# Altium project ESE5160_Co1n1oT.PrjPcb (part 1 of 2)
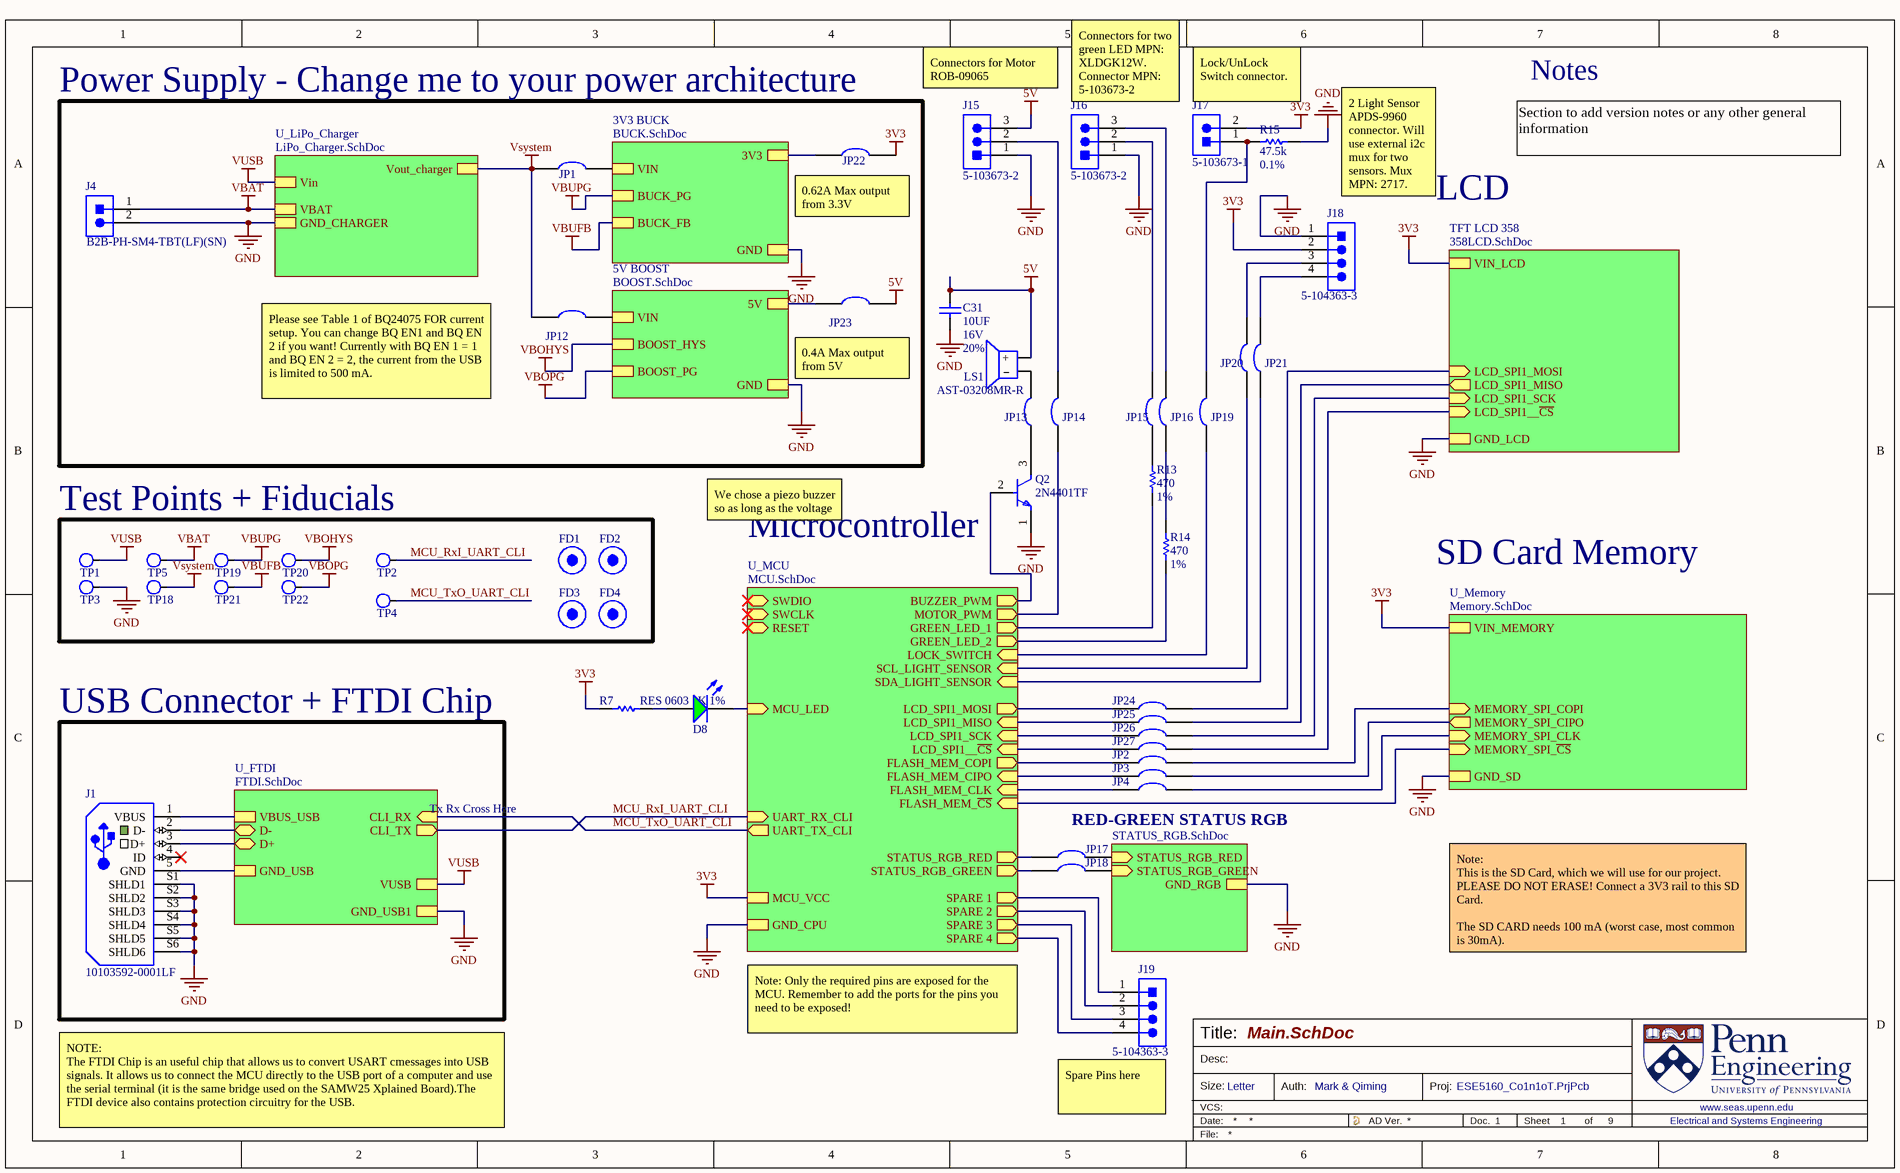
[diagram p0: Main.SchDoc]
9 sheets, 129 parts. Net scope: strictly hierarchical (ports join the sheet entries above them; power ports are local).
Board file: Co1n1oT.PcbDoc
Sheets:
  Main.SchDoc
    U_FTDI = FTDI.SchDoc
    U_MCU = MCU.SchDoc
    U_LiPo_Charger = LiPo_Charger.SchDoc
    U_Memory = Memory.SchDoc
    3V3 BUCK = BUCK.SchDoc
    5V BOOST = BOOST.SchDoc
    RED-GREEN STATUS RGB = STATUS_RGB.SchDoc
    TFT LCD 358 = 358LCD.SchDoc

## Sheet Main.SchDoc
size Legal; Author: Mark & Qiming; DocumentNumber: 1; SheetNumber: 1; SheetTotal: 9

### Parts
C31  value 10UF  Voltage: 16V  Tolerance: 20%  [0603_CAP]  (hidden comment: CAP 0603 10UF 16V 20% X5R)
D8  LSM0805452V  [LED_0805]  (value not drawn)
FD1  Fiducial 40x100mm  [Fiducial 40x100mm-Footprint-1]  (value not drawn)  (no BOM)
FD2  Fiducial 40x100mm  [Fiducial 40x100mm-Footprint-1]  (value not drawn)  (no BOM)
FD3  Fiducial 40x100mm  [Fiducial 40x100mm-Footprint-1]  (value not drawn)  (no BOM)
FD4  Fiducial 40x100mm  [Fiducial 40x100mm-Footprint-1]  (value not drawn)  (no BOM)
J1  10103592-0001LF  [10103592-0001LF-Footprint-1]
J4  B2B-PH-SM4-TBT(LF)(SN)  [FP-B2B-PH-SM4-TBT_LF_SN-MFG]
J15  5-103673-2  [5-103673-2-Footprint-1]
J16  5-103673-2  [5-103673-2-Footprint-1]
J17  5-103673-1  [5-103672-1-Footprint-1]
J18  5-104363-3  [5-104363-3-Footprint-1]
J19  5-104363-3  [5-104363-3-Footprint-1]
JP1  0603 link  [0603_JP_RES]  (value not drawn)  (net tie, no BOM)
JP2  0603 link  [0603_JP_RES]  (value not drawn)  (net tie, no BOM)
JP3  0603 link  [0603_JP_RES]  (value not drawn)  (net tie, no BOM)
JP4  0603 link  [0603_JP_RES]  (value not drawn)  (net tie, no BOM)
JP12  0603 link  [0603_JP_RES]  (value not drawn)  (net tie, no BOM)
JP13  0603 link  [0603_JP_RES]  (value not drawn)  (net tie, no BOM)
JP14  0603 link  [0603_JP_RES]  (value not drawn)  (net tie, no BOM)
JP15  0603 link  [0603_JP_RES]  (value not drawn)  (net tie, no BOM)
JP16  0603 link  [0603_JP_RES]  (value not drawn)  (net tie, no BOM)
JP17  0603 link  [0603_JP_RES]  (value not drawn)  (net tie, no BOM)
JP18  0603 link  [0603_JP_RES]  (value not drawn)  (net tie, no BOM)
JP19  0603 link  [0603_JP_RES]  (value not drawn)  (net tie, no BOM)
JP20  0603 link  [0603_JP_RES]  (value not drawn)  (net tie, no BOM)
JP21  0603 link  [0603_JP_RES]  (value not drawn)  (net tie, no BOM)
JP22  0603 link  [0603_JP_RES]  (value not drawn)  (net tie, no BOM)
JP23  0603 link  [0603_JP_RES]  (value not drawn)  (net tie, no BOM)
JP24  0603 link  [0603_JP_RES]  (value not drawn)  (net tie, no BOM)
JP25  0603 link  [0603_JP_RES]  (value not drawn)  (net tie, no BOM)
JP26  0603 link  [0603_JP_RES]  (value not drawn)  (net tie, no BOM)
JP27  0603 link  [0603_JP_RES]  (value not drawn)  (net tie, no BOM)
LS1  AST-03208MR-R  [AST-03208MR-R]
Q2  2N4401TF  [FP-135AR-MFG]
R7  RES 0603 1K 1%  [0603_RES]
R13  value 470  Tolerance: 1%  [0805_RES]  (hidden comment: RES 0805 470 1%)
R14  value 470  Tolerance: 1%  [0805_RES]  (hidden comment: RES 0805 470 1%)
R15  value 47.5k  Tolerance: 0.1%  [0805_RES]  (hidden comment: RES 0805 47.5K 0.1%)
TP1  Testpad  [SMT Testpoint, 50mil]  (value not drawn)  (no BOM)
TP2  Testpad  [SMT Testpoint, 50mil]  (value not drawn)  (no BOM)
TP3  Testpad  [SMT Testpoint, 50mil]  (value not drawn)  (no BOM)
TP4  Testpad  [SMT Testpoint, 50mil]  (value not drawn)  (no BOM)
TP5  Testpad  [Test PTH 27-50]  (value not drawn)  (no BOM)
TP18  Testpad  [Test PTH 27-50]  (value not drawn)  (no BOM)
TP19  Testpad  [SMT Testpoint, 50mil]  (value not drawn)  (no BOM)
TP20  Testpad  [SMT Testpoint, 50mil]  (value not drawn)  (no BOM)
TP21  Testpad  [SMT Testpoint, 50mil]  (value not drawn)  (no BOM)
TP22  Testpad  [SMT Testpoint, 50mil]  (value not drawn)  (no BOM)

### Blocks framed on the sheet
Power Supply - Change me to your power architecture: J4 JP1 JP12 JP22 JP23
Test Points + Fiducials: FD1-FD4 TP1-TP5 TP18-TP22
USB Connector + FTDI Chip: J1

### Sub-sheets
3V3 BUCK = BUCK.SchDoc: 3V3, VIN, BUCK_PG, BUCK_FB, GND
5V BOOST = BOOST.SchDoc: VIN, 5V, BOOST_HYS, BOOST_PG, GND
RED-GREEN STATUS RGB = STATUS_RGB.SchDoc: STATUS_RGB_RED (in), STATUS_RGB_GREEN (in), GND_RGB
TFT LCD 358 = 358LCD.SchDoc: LCD_SPI1_MOSI (in), LCD_SPI1_MISO (out), LCD_SPI1__~{CS} (in), LCD_SPI1_SCK (in), GND_LCD, VIN_LCD
U_FTDI = FTDI.SchDoc: CLI_RX (in), CLI_TX (out), VUSB, GND_USB1, VBUS_USB, D- (bidir), D+ (bidir), GND_USB
U_LiPo_Charger = LiPo_Charger.SchDoc: Vin, GND_CHARGER, VBAT, Vout_charger
U_MCU = MCU.SchDoc: SWDIO (bidir), SWCLK (in), UART_TX_CLI (out), UART_RX_CLI (in), RESET (bidir), MCU_LED (in), MCU_VCC, GND_CPU, FLASH_MEM_~{CS} (in), FLASH_MEM_CLK (in), FLASH_MEM_CIPO (in), FLASH_MEM_COPI (out), MOTOR_PWM (out), GREEN_LED_1 (out), GREEN_LED_2 (out), BUZZER_PWM (out), STATUS_RGB_GREEN (out), STATUS_RGB_RED (out), LOCK_SWITCH (in), SCL_LIGHT_SENSOR (in), SDA_LIGHT_SENSOR (in), LCD_SPI1_SCK (in), LCD_SPI1__~{CS} (in), LCD_SPI1_MOSI (out), LCD_SPI1_MISO (in), SPARE 1 (out), SPARE 2 (out), SPARE 3 (out), SPARE 4 (out)
U_Memory = Memory.SchDoc: MEMORY_SPI_COPI (in), MEMORY_SPI_CIPO (out), MEMORY_SPI_CLK (in), MEMORY_SPI_~{CS} (in), VIN_MEMORY, GND_SD

### Nets
3V3: J17.2 J18.2 JP22.2 R7.2 ; sheet U_MCU/MCU_VCC, sheet U_Memory/VIN_MEMORY, sheet TFT LCD 358/VIN_LCD
5V: C31.2 J15.3 JP23.2 LS1.1(+)
GND: C31.1 J1.5(GND) J1.S1(SHLD1) J1.S2(SHLD2) J1.S3(SHLD3) J1.S4(SHLD4) J1.S5(SHLD5) J1.S6(SHLD6) J4.2 J15.1 J16.1 J18.1 Q2.1(E) R15.2 TP3.1 ; sheet U_FTDI/GND_USB1, sheet U_FTDI/GND_USB, sheet U_MCU/GND_CPU, sheet U_LiPo_Charger/GND_CHARGER, sheet U_Memory/GND_SD, sheet 3V3 BUCK/GND, sheet 5V BOOST/GND, sheet RED-GREEN STATUS RGB/GND_RGB, sheet TFT LCD 358/GND_LCD
IN: JP12.2 ; sheet 5V BOOST/VIN
OUT: JP22.1 ; sheet 3V3 BUCK/3V3
VBAT: J4.1 TP5.1 ; sheet U_LiPo_Charger/VBAT
VBOHYS: TP20.1 ; sheet 5V BOOST/BOOST_HYS
VBOPG: TP22.1 ; sheet 5V BOOST/BOOST_PG
VBUFB: TP21.1 ; sheet 3V3 BUCK/BUCK_FB
VBUPG: TP19.1 ; sheet 3V3 BUCK/BUCK_PG
VBUS: J1.1(VBUS) ; sheet U_FTDI/VBUS_USB
VIN: JP1.2 ; sheet 3V3 BUCK/VIN
Vout: JP23.1 ; sheet 5V BOOST/5V
Vsystem: JP1.1 JP12.1 TP18.1 ; sheet U_LiPo_Charger/Vout_charger
VUSB: TP1.1 ; sheet U_FTDI/VUSB, sheet U_LiPo_Charger/Vin
BUZZER PWM-: Q2.2(B) ; sheet U_MCU/BUZZER_PWM
FLASH_MEM_SPI_~{CS}: sheet U_MCU/FLASH_MEM_~{CS}, sheet U_Memory/MEMORY_SPI_~{CS}
GREEN_LED_1: R13.1 ; sheet U_MCU/GREEN_LED_1
GREEN_LED_2: R14.1 ; sheet U_MCU/GREEN_LED_2
I2C_0(SCL) LIGHT SENSOR: JP20.1 ; sheet U_MCU/SCL_LIGHT_SENSOR
I2C_0(SDA) LIGHT SENSOR: JP21.1 ; sheet U_MCU/SDA_LIGHT_SENSOR
LCD_~{CS}: JP27.2 ; sheet TFT LCD 358/LCD_SPI1__~{CS}
LCD_CLK: JP26.2 ; sheet TFT LCD 358/LCD_SPI1_SCK
LCD_MISO: JP25.2 ; sheet TFT LCD 358/LCD_SPI1_MISO
LCD_MOSI: JP24.2 ; sheet TFT LCD 358/LCD_SPI1_MOSI
LCD_SPI1_~{CS}: JP27.1 ; sheet U_MCU/LCD_SPI1__~{CS}
LCD_SPI1_CLK: JP26.1 ; sheet U_MCU/LCD_SPI1_SCK
LCD_SPI1_MISO: JP25.1 ; sheet U_MCU/LCD_SPI1_MISO
LCD_SPI1_MOSI: JP24.1 ; sheet U_MCU/LCD_SPI1_MOSI
LOCK_SIGNAL_SWITCH: JP19.1 ; sheet U_MCU/LOCK_SWITCH
MCU_LED: D8.K ; sheet U_MCU/MCU_LED
MCU_RxI_UART_CLI: TP2.1 ; sheet U_FTDI/CLI_TX, sheet U_MCU/UART_RX_CLI
MCU_TxO_UART_CLI: TP4.1 ; sheet U_FTDI/CLI_RX, sheet U_MCU/UART_TX_CLI
MEM_SPI_CIPO: JP3.2 ; sheet U_Memory/MEMORY_SPI_CIPO
MEM_SPI_CLK: JP4.2 ; sheet U_Memory/MEMORY_SPI_CLK
MEM_SPI_COPI: JP2.2 ; sheet U_Memory/MEMORY_SPI_COPI
MOTOR PWM+: JP14.1 ; sheet U_MCU/MOTOR_PWM
SERCOM1_PAD2_SPI_CIPO: JP3.1 ; sheet U_MCU/FLASH_MEM_CIPO
SERCOM1_PAD2_SPI_COPI: JP2.1 ; sheet U_MCU/FLASH_MEM_COPI
SERCOM1_PAD3_SPI_SCK: JP4.1 ; sheet U_MCU/FLASH_MEM_CLK
SPARE 1: J19.1 ; sheet U_MCU/SPARE 1
SPARE 2: J19.2 ; sheet U_MCU/SPARE 2
SPARE 3: J19.3 ; sheet U_MCU/SPARE 3
SPARE 4: J19.4 ; sheet U_MCU/SPARE 4
STATUS RGB PIN_1: JP17.1 ; sheet U_MCU/STATUS_RGB_RED
STATUS RGB PIN_2: JP18.1 ; sheet U_MCU/STATUS_RGB_GREEN
STATUS_RGB_GREEN: JP18.2 ; sheet RED-GREEN STATUS RGB/STATUS_RGB_GREEN
STATUS_RGB_RED: JP17.2 ; sheet RED-GREEN STATUS RGB/STATUS_RGB_RED
USB_DATA_N: J1.2(D-) ; sheet U_FTDI/D-
USB_DATA_P: J1.3(D+) ; sheet U_FTDI/D+
NetD8_A: D8.A R7.1
NetJ15_2: J15.2 JP14.2
NetJ16_2: J16.2 JP15.2
NetJ16_3: J16.3 JP16.2
NetJ17_1: J17.1 JP19.2 R15.1
NetJ18_3: J18.3 JP20.2
NetJ18_4: J18.4 JP21.2
NetJP13_1: JP13.1 Q2.3(C)
NetJP13_2: JP13.2 LS1.2(‒)
NetJP15_1: JP15.1 R13.2
NetJP16_1: JP16.1 R14.2

Not connected (* = marked no-connect by the designer): FD1 0(PAD); FD2 0(PAD); FD3 0(PAD); FD4 0(PAD); J1 4(ID)*

### Notes on the sheet
- Connectors for Motor ROB-09065
- (near J16) Connectors for two green LED MPN: XLDGK12W. Connector MPN: 5-103673-2
- Lock/UnLock Switch connector.
- Notes
- Section to add version notes or any other general information
- (near JP22) 0.62A Max output from 3.3V
- 2 Light Sensor APDS-9960 connector. Will use external i2c mux for two sensors. Mux MPN: 2717.
- LCD
- 0.4A Max output from 5V
- Please see Table 1 of BQ24075 FOR current setup. You can change BQ EN1 and BQ EN 2 if you want! Currently with BQ EN 1 = 1 and BQ EN 2 = 2, the current from the USB is limited to 500 mA.
- We chose a piezo buzzer so as long as the voltage is correct and we limit the current it should be good
- (near Q2) Microcontroller
- SD Card Memory
- Tx Rx Cross Here
- Note:
  This is the SD Card, which we will use for our project. PLEASE DO NOT ERASE! Connect a 3V3 rail to this SD Card.
  The SD CARD needs 100 mA (worst case, most common is 30mA).
- Note: Only the required pins are exposed for the MCU. Remember to add the ports for the pins you need to be exposed!
- NOTE:
  The FTDI Chip is an useful chip that allows us to convert USART cmessages into USB signals. It allows us to connect the MCU directly to the USB port of a computer and use the serial terminal (it is the same bridge used on the SAMW25 Xplained Board).The FTDI device also contains protection circuitry for the USB.
- (near J19) Spare Pins here
- Title:
- Desc:
- Size:
- Letter
- Auth:
- Proj:
- Sheet
- of
- www.seas.upenn.edu
- Electrical and Systems Engineering

### Library data of the parts
C31 = CMP-011-000263-1: Capacitor Surface Mount 0603 Footprint 10UF 16V 20% Tolerance Ceramic X5R; Manufacturer: Various; Description in Visual: Cap SMT 0603 10UF 16V 20% Ceramic X5R; PCB Package: 0603; Type: Ceramic X5R; Mount: SMT; P/N: CAP 0603 10UF 16V 20% X5R; Manufacturer P/N: CAP 0603 10UF 16V 20% X5R
D8 = CMP-00038-3: Single Color LED, Green, 0805; Test Current: 20mA; Forward Voltage: 2V; RoHS Compliant: Yes
FD1 FD3 FD4 = CMP-00085-3
FD2 = CMP-00085-2
J1 = CMP-00092-5: Conn Micro USB 2.0 Type B RCP 5 POS 0.65mm Solder RA SMD 5 Terminal 1 Port T/R
J4 = CMP-00418-1: Connector Header, PH Series, 2 Position, 2.00mm, 100V, Surface Mount, Solder, Pick and Place, Natural.
J15 J16 = CMP-00385-1: Board Connector, 3 Contact(s), 1 Row(s), Male, Right Angle, Solder Terminal, Black Insulator; Option: General Purpose; MIL Conformance: No; Number of Contacts: 3; Mating Information: MULTIPLE MATING PARTS AVAILABLE; Number of Rows Loaded: 1; Additional Feature: POLARIZED; Flammability Rating: UL94 V-0; RoHS Compliant: Yes; JESD-609 Code: e3; Contact Finish - Mating: NOT SPECIFIED; Reach SVHC Compliant: Yes; Connector Type: BOARD CONNECTOR; Filter Feature: No; IEC Conformance: No; Mounting Style: RIGHT ANGLE; Terminal Pitch: 2.54mm; Contact Material: Brass; Termination: Solder; Mounting Technology: Board; Mixed Contacts: No; Contact Finish - Termination: TIN; Contact Gender: Male; DIN Conformance: No
J17 = CMP-00384-1: Board Connector, 2 Contact(s), 1 Row(s), Male, Right Angle, 0.1 inch Pitch, Solder Terminal, Latch, Black Insulator, Receptacle; DIN Conformance: No; Rated Current (Signal): 3A; Number of Contacts: 2; Contact Pattern: RECTANGULAR; Body Depth: 0.535inch; Number Of PCB Rows: 1; Mating Information: MULTIPLE MATING PARTS AVAILABLE; Contact Style: SQ PIN-SKT; Option: General Purpose; Body Breadth: 0.275inch; Additional Feature: POLARIZED; Dielectric Withstanding Voltage (AC): 600V; Contact Resistance: 15mR; Plating Thickness: 15uin; Mounting Option 2: LOCKING; Reliability: COMMERCIAL; Body Length: 0.3inch; Insulation Resistance: 5GR; Board Mounting Option: HOLE .125-.137; Reference Standard: UL; Polarization Key: POLARIZED HOUSING; Min Operating Temperature: -65°C; Mating Contact Pitch: 0.1inch; Contact Gender: Male; Mounting Option 1: LATCH; Mounting Style: RIGHT ANGLE; Terminal Length: 0.13inch; Contact Material: Brass; PCB Contact Pattern: RECTANGULAR; JESD-609 Code: e3; Mounting Technology: Board; Body/Shell Style: RECEPTACLE; Contact Finish - Mating: NOT SPECIFIED; Number of Rows Loaded: 1; Termination: Solder; Terminal Pitch: 2.54mm; Contact Finish - Termination: TIN; IEC Conformance: No; Filter Feature: No; MIL Conformance: No; Reach SVHC Compliant: Yes; Number Of Connectors: 1; Insulation Material: Thermoplastic; Connector Type: BOARD CONNECTOR; Max Operating Temperature: 105°C; Mixed Contacts: No; Flammability Rating: UL94 V-0; Insulation Color: Black; RoHS Compliant: Yes
J18 J19 = CMP-00105-2: Board Connector, 4 Contact(s), 1 Row(s), Male, Straight, 0.1 inch Pitch, Solder Terminal, Locking, Black Insulator, Plug
JP1-JP4 JP12-JP27 = CMP-00422-2: 0O link, SMD, 0603, Solder Bridge Option; Manufacturer P/N: Various; Manufacturer: Generic; Description in Visual: 0O link, Solder Bridge/SMD, Open; Value: 0.025; Source: Shunts and Jumpers.SchLib; Pin Count: 2; Design Item ID: 0603 link; Component Type: Net Tie; P/N: 0603 link
LS1 = CMP-000049-2: 8 Ohms General Purpose Speaker 100 mW 500 Hz ~ 20 kHz Top Round
Q2 = CMP-00278-84408871-1: 2N4401TF Transistor General Purpose BJT NPN 40 Volt 0.6 Amp 3-Pin TO-92 Tape And Reel; Manufacturer Lifecycle Status: ACTIVE; Collector Emitter Voltage (VCEO): 40V; Max Frequency: 250MHz; Current Rating: 600mA; Element Configuration: Single; Max Power Dissipation: 625mW; Emitter Base Voltage (VEBO): 6V; Collector Emitter Saturation Voltage: 400mV; Max Junction Temperature (Tj): 150°C; Collector Base Voltage (VCBO): 60V; Number of Elements: 1; hFE Min: 100; Lifecycle Status: Production; Collector Emitter Breakdown Voltage: 40V; Lead Free: Lead Free; Gain Bandwidth Product: 250MHz; Number of Pins: 3; Length: 5.2mm; Case/Package: TO-92; RoHS: Compliant; Radiation Hardening: No; Height: 5.33mm; Schedule B: 8541210080, 8541210080; Voltage Rating (DC): 40V; REACH SVHC: No SVHC; Frequency: 250MHz; Width: 4.19mm; Power Dissipation: 625mW; Transition Frequency: 250MHz; Weight: 240mg; Mount: Through Hole; Polarity: NPN; Max Operating Temperature: 150°C; Min Operating Temperature: -55°C; NexarPartId: 84408871; Max Breakdown Voltage: 40V; Packaging: Tape and Reel; Max Collector Current: 600mA
R7 = CMP-005-002503-3: Resistor Surface Mount, 1K Ohms, 0603 Footprint, 1% Tolerance 0.1W; Manufacturer: Various; PCB Package: 0603; Description in Visual: Res SMT 1K 0603  1%  0.1W; Tolerance: 1%; Value: 1k; Mount: SMT; Power Rating: 0.1W; Manufacturer P/N: RES 0603 1K 1%; JLCPCB Part #: C21190
R13 R14 = CMP-005-005142-2: Resistor Surface Mount, 470 Ohms, 0805 Footprint, 1% Tolerance 0.125W; Manufacturer P/N: RES 0805 470R 1%; Manufacturer: Various; PCB Package: 0805; Description in Visual: Res SMT 470 0805  1%  0.125W; Power Rating: 0.125W; Mount: SMT
R15 = CMP-005-005139-2: Resistor Surface Mount, 47.5K Ohms, 0805 Footprint, 0.1% Tolerance 0.125W; Manufacturer: Various; PCB Package: 0805; Description in Visual: Res SMT 47.5K 0805  0.1%  0.125W; Mount: SMT; Power Rating: 0.125W; Manufacturer P/N: RES 0805 47.5K 0.1%
TP1-TP5 TP18-TP22 = CMP-00049-4: Test Pad/Point (Testpoint, Testpad), for probing

## Sheet FTDI.SchDoc
size Legal; Author: Mark & Qiming; DocumentNumber: 5; SheetNumber: 5; SheetTotal: 9
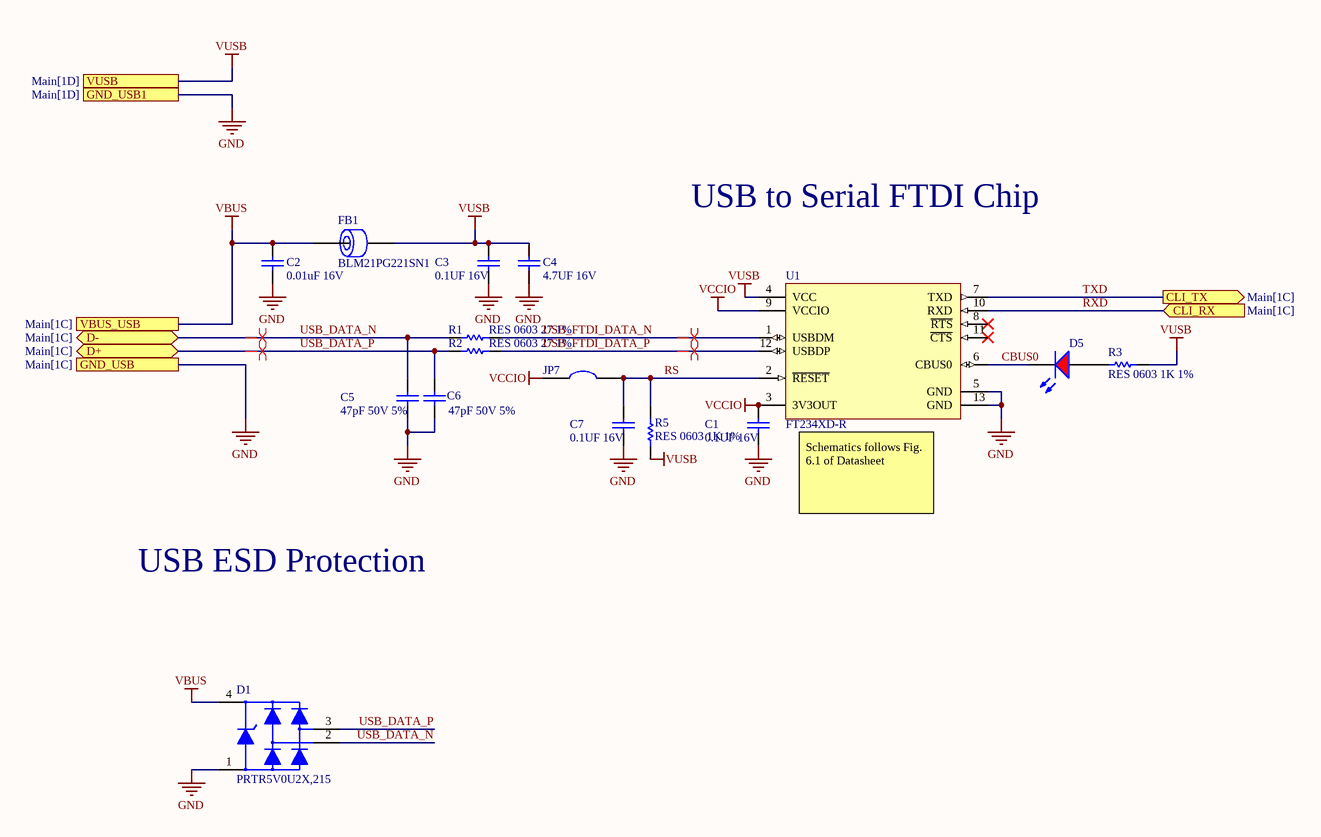
[diagram p1: FTDI.SchDoc]

### Parts
C1  0.1UF 16V  [0603_CAP]
C2  0.01uF 16V  [0603_CAP]
C3  0.1UF 16V  [0603_CAP]
C4  4.7UF 16V  [0805_CAP]
C5  47pF 50V 5%  [0603_CAP]
C6  47pF 50V 5%  [0603_CAP]
C7  0.1UF 16V  [0603_CAP]
D1  PRTR5V0U2X,215  [FP-SOT143B-NXP]
D5  LSM0805412V  [LED_0805_RED]  (value not drawn)
FB1  BLM21PG221SN1  [0805]
JP7  0603 link  [0603_JP_RES]  (value not drawn)  (net tie, no BOM)
R1  RES 0603 27 1%  [0603_RES]
R2  RES 0603 27 1%  [0603_RES]
R3  RES 0603 1K 1%  [0603_RES]
R5  RES 0603 1K 1%  [0603_RES]
U1  FT234XD-R  [FP-DFN-12-MFG]

### Ports
CLI_RX (in, see Main[1C]), CLI_TX (out, see Main[1C]), D+ (bidir, see Main[1C]), D- (bidir, see Main[1C]), GND_USB1 (see Main[1D]), GND_USB (see Main[1C]), VBUS_USB (see Main[1C]), VUSB (see Main[1D])

### Nets
GND: C1.1 C2.1 C3.1 C4.1 C5.1 C6.1 C7.1 D1.1 U1.5(GND) U1.13(GND) ; port GND_USB1, port GND_USB
VBUS: C2.2 D1.4 FB1.1 ; port VBUS_USB
VCCIO: C1.2 JP7.1 U1.3(3V3OUT) U1.9(VCCIO)
VUSB: C3.2 C4.2 FB1.2 R3.1 R5.1 U1.4(VCC) ; port VUSB
CBUS0: D5.K U1.6(CBUS0)  [project net CBUS0_5]
RS: C7.2 JP7.2 R5.2 U1.2(~{RESET})  [project net RS_5]
RXD: U1.10(RXD) ; port CLI_RX  [project net MCU_TxO_UART_CLI]
TXD: U1.7(TXD) ; port CLI_TX  [project net MCU_RxI_UART_CLI]
USB_DATA_N: C5.2 D1.2 R1.1 ; port D-
USB_DATA_P: C6.2 D1.3 R2.1 ; port D+
USB_FTDI_DATA_N: R1.2 U1.1(USBDM)  [project net USB_FTDI_DATA_N_5]
USB_FTDI_DATA_P: R2.2 U1.12(USBDP)  [project net USB_FTDI_DATA_P_5]
NetD5_A: D5.A R3.2

Not connected (* = marked no-connect by the designer): U1 8(~{RTS})* 11(~{CTS})*

### Layout directives
differential pair; differential pair class USB; net class USB: USB_DATA_N, USB_DATA_P, USB_FTDI_DATA_N_5, USB_FTDI_DATA_P_5

### Notes on the sheet
- USB to Serial FTDI Chip
- Schematics follows Fig. 6.1 of Datasheet
- USB ESD Protection
- Title:
- Desc:
- Size:
- Letter
- Auth:
- Proj:
- Sheet
- of
- www.seas.upenn.edu
- Electrical and Systems Engineering

### Library data of the parts
C1 C3 C7 = CMP-011-000221-1: Capacitor Surface Mount 0603 Footprint 0.1UF 16V 10% Tolerance Ceramic X7R; Manufacturer P/N: CAP 0603 0.1UF 16V 10% X7R; Manufacturer: Various; Description in Visual: Cap SMT 0603 0.1UF 16V 10%  Cer X7R; PCB Package: 0603; Mount: SMT; Type: Ceramic X7R; Voltage: 16V; P/N: CAP 0603 0.1UF 16V 10% X7R; Value: 0.1UF; Tolerance: 10%
C2 = CMP-011-000185-1: Capacitor Surface Mount 0603 Footprint 0.01UF 16V 10% Tolerance Ceramic X7R; Manufacturer: Various; Manufacturer P/N: CAP 0603 0.01UF 16V 10% X7R; Description in Visual: Cap SMT 0603 0.01UF 16V 10%  Cer X7R; PCB Package: 0603; Type: Ceramic X7R; Value: 0.01UF; P/N: CAP 0603 0.01UF 16V 10% X7R; Voltage: 16V; Tolerance: 10%; Mount: SMT
C4 = CMP-011-000523-1: Capacitor Surface Mount 0805 Footprint 4.7UF 16V 10% Tolerance Ceramic X7R; Manufacturer P/N: CAP 0805 4.7UF 16V 10% X7R; Manufacturer: Various; PCB Package: 0805; Description in Visual: Cap SMT 0805 4.7UF 16V 10%  Cer X7R; Mount: SMT; P/N: CAP 0805 4.7UF 16V 10% X7R; Type: Ceramic X7R; Voltage: 16V; Tolerance: 10%; Value: 4.7UF
C5 C6 = CMP-011-000339-1: Capacitor Surface Mount 0603 Footprint 47PF 50V 5% Tolerance Ceramic C0G; Manufacturer P/N: CAP 0603 47PF 50V 5% C0G; Manufacturer: Various; Description in Visual: Cap SMT 0603 47PF 50V 5%  Cer C0G; PCB Package: 0603; Value: 47PF; Voltage: 50V; P/N: CAP 0603 47PF 50V 5% C0G; Mount: SMT; Tolerance: 5%; Type: Ceramic C0G
D1 = CMP-00371-1: Trans Voltage Suppressor Diode, 5.5V V(RWM), Unidirectional, 1 Element, Silicon; Min Breakdown Voltage: 6V; Number of Elements: 1; Time @ Peak Reflow Temperature-Max (s): 30s; Max Breakdown Voltage: 9V; Package Body Material: Plastic; Case Connection: ANODE; Surface Mount: Yes; Terminal Finish: Tin; Package Style: SMALL OUTLINEMeter; Moisture Sensitivity Level: 1; Reach SVHC Compliant: Yes; Terminal Position: DUAL; Pins: 4; Polarity: Unidirectional; Diode Type: TRANS VOLTAGE SUPPRESSOR; Package Shape: Rectangular; Terminal Form: Gull Wing; RoHS Compliant: Yes; JESD-609 Code: e3; Rep Pk Reverse Voltage-Max: 5.5V; Diode Element Material: SILICON; JESD-30 Code: R-PDSO-G4; Technology: AVALANCHE; Peak Reflow Temperature (Cel): 260°C
D5 = CMP-00026-00001-1: Single Color LED, RED, 0805; Test Current: 20mA; Forward Voltage: 2V; RoHS Compliant: Yes
FB1 = CMP-00229-4: Ferrite Chip 2000 mA 220 Ohms Differential Mode - Single 0805 Footprint; Manufacturer: Murata; Description in Visual: Ferrite SMT 2000mA 220Ohm Dif Mode 0805; Frequency: 100MHz; Usage: Power Supply; DC Resistance (ohms): 0.05; Impedance at Freq (ohms): 220Hz; Current (mA): 2000; ComponentLink3Description: Octopart Link; PCB Package: 0805; Operating Temperature Range: -55 to +125 °C; ComponentLink2URL: http://search.murata.co.jp/Ceramy/image/img/PDF/ENG/L0110S0100BLM21P.pdf; ComponentLink3URL: http://octopart.com/partsearch/#search/requestData&q=BLM21PG221SN1; ComponentLink1URL: http://www.murata.com; Manufacturer P/N: BLM21PG221SN1; ComponentLink2Description: Component Datasheet; ComponentLink1Description: Manufacturer Website; Filter type: Differential Mode - Single; P/N: BLM21PG221SN1
JP7 = CMP-00422-2: as JP1 on sheet Main; Source: Shunts and Jumpers.SchLib; Pin Count: 2; Design Item ID: 0603 link; Component Type: Net Tie; P/N: 0603 link
R1 R2 = CMP-005-002764-2: Resistor Surface Mount, 27 Ohms, 0603 Footprint, 1% Tolerance 0.1W; Manufacturer P/N: RES 0603 27R 1%; Manufacturer: Various; Description in Visual: Res SMT 27 0603  1%  0.1W; Value: 27; PCB Package: 0603; Mount: SMT; Tolerance: 1%; Power Rating: 0.1W
R3 R5 = CMP-005-002503-3: as R7 on sheet Main; Tolerance: 1%; Value: 1k; Mount: SMT; Power Rating: 0.1W; Manufacturer P/N: RES 0603 1K 1%; JLCPCB Part #: C21190
U1 = CMP-00104-3: USB Bridge, USB to UART USB 2.0 UART Interface 12-DFN (3x3); Nominal Supply Voltage: 5V; Qualification Status: Not Qualified; Package Body Material: Plastic; Time @ Peak Reflow Temperature-Max (s): 40s; Min Supply Voltage: 2.97V; Max Supply Voltage: 5.5V; Power Supplies: 1.8/3.3,3.3/5V; Package Style: SMALL OUTLINE, HEAT SINK/SLUG, THIN PROFILEMeter; Technology: CMOS; Terminal Pitch: 0.45mm; Terminal Position: DUAL; Moisture Sensitivity Level: 3; Reach SVHC Compliant: Yes; Length: 3mm; Package Shape: Square; Pins: 12; RoHS Compliant: Yes; Temperature Grade: INDUSTRIAL; Min Operating Temperature: -40°C; Peak Reflow Temperature (Cel): 260°C; Surface Mount: Yes; Terminal Form: No Lead; Max Operating Temperature: 85°C; Case/Package: HTSON; Width: 3mm

## Sheet MCU.SchDoc
size Legal; Author: Mark & Qiming; DocumentNumber: 3; SheetNumber: 3; SheetTotal: 9
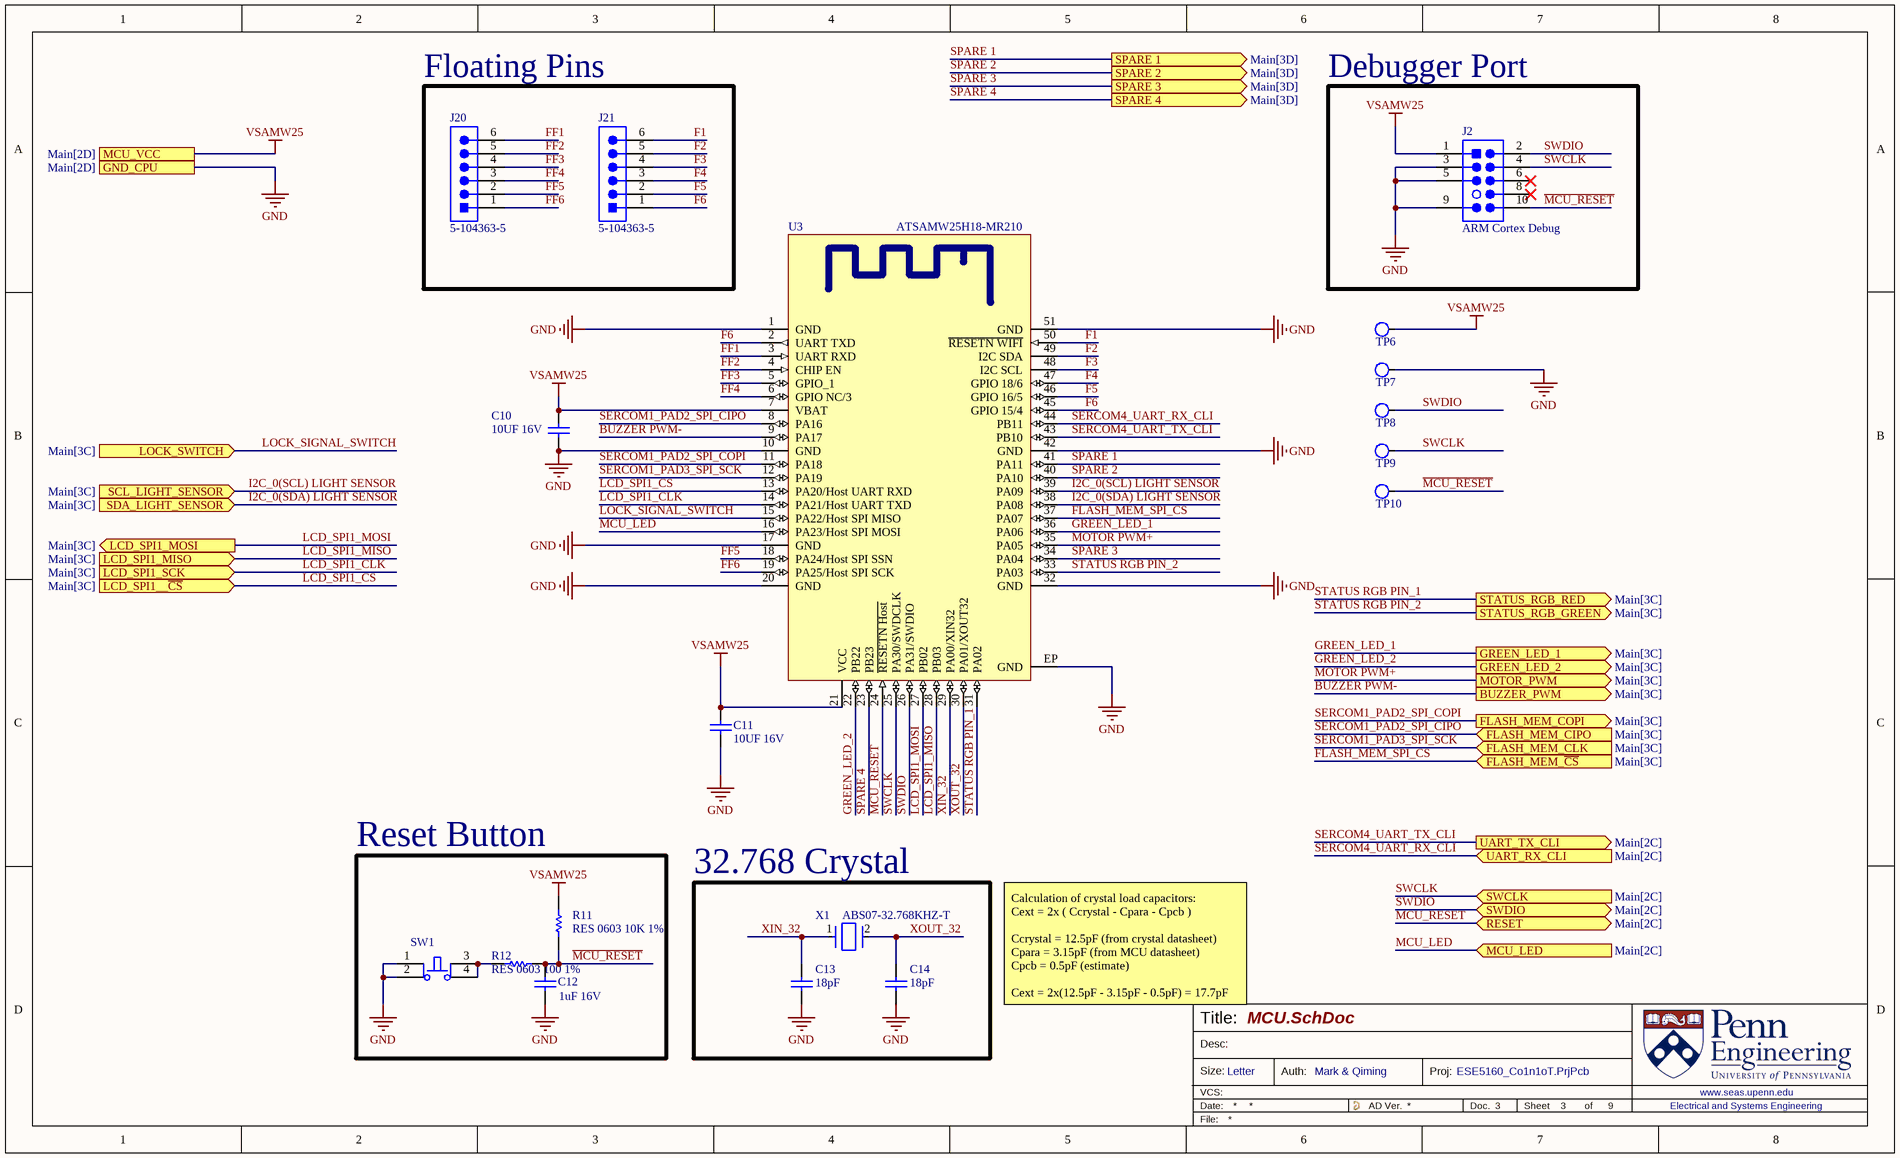
[diagram p2: MCU.SchDoc]

### Parts
C10  10UF 16V  [0805_CAP_60H]
C11  10UF 16V  [0805_CAP_60H]
C12  1uF 16V  [0603_CAP]
C13  18pF  [0603_CAP]
C14  18pF  [0603_CAP]
J2  ARM Cortex Debug  [FTSH-105-01-F-DV-007-K PLUGIN]
J20  5-104363-5  [5-104363-5-Footprint-1]
J21  5-104363-5  [5-104363-5-Footprint-1]
R11  RES 0603 10K 1%  [0603_RES]
R12  RES 0603 100 1%  [0603_RES]
SW1  PTS810SJK250SMTRLFS  [PTS810SJK250SMTRLFS-Footprint-1]  (value not drawn)
TP6  Testpad  [SMT Testpoint, 50mil]  (value not drawn)  (no BOM)
TP7  Testpad  [SMT Testpoint, 50mil]  (value not drawn)  (no BOM)
TP8  Testpad  [SMT Testpoint, 50mil]  (value not drawn)  (no BOM)
TP9  Testpad  [SMT Testpoint, 50mil]  (value not drawn)  (no BOM)
TP10  Testpad  [SMT Testpoint, 50mil]  (value not drawn)  (no BOM)
U3  ATSAMW25H18-MR210  [ATSAMW25H18-MR210-Footprint-1]
X1  ABS07-32.768KHZ-T  [FP-ABS07-MFG]

### Blocks framed on the sheet
Floating Pins: J20 J21
Debugger Port: J2
Reset Button: C12 R11 R12 SW1
32.768 Crystal: C13 C14 X1

### Ports
BUZZER_PWM (out, see Main[3C]), FLASH_MEM_CIPO (in, see Main[3C]), FLASH_MEM_CLK (in, see Main[3C]), FLASH_MEM_COPI (out, see Main[3C]), FLASH_MEM_~{CS} (in, see Main[3C]), GND_CPU (see Main[2D]), GREEN_LED_1 (out, see Main[3C]), GREEN_LED_2 (out, see Main[3C]), LCD_SPI1__~{CS} (in, see Main[3C]), LCD_SPI1_MISO (in, see Main[3C]), LCD_SPI1_MOSI (out, see Main[3C]), LCD_SPI1_SCK (in, see Main[3C]), LOCK_SWITCH (in, see Main[3C]), MCU_LED (in, see Main[2C]), MCU_VCC (see Main[2D]), MOTOR_PWM (out, see Main[3C]), RESET (bidir, see Main[2C]), SCL_LIGHT_SENSOR (in, see Main[3C]), SDA_LIGHT_SENSOR (in, see Main[3C]), SPARE 1 (out, see Main[3D]), SPARE 2 (out, see Main[3D]), SPARE 3 (out, see Main[3D]), SPARE 4 (out, see Main[3D]), STATUS_RGB_GREEN (out, see Main[3C]), STATUS_RGB_RED (out, see Main[3C]), SWCLK (in, see Main[2C]), SWDIO (bidir, see Main[2C]), UART_RX_CLI (in, see Main[2C]), UART_TX_CLI (out, see Main[2C])

### Nets
GND: C10.1 C11.2 C12.1 C13.1 C14.1 J2.3 J2.5 J2.9 SW1.1 SW1.2 TP7.1 U3.1(GND) U3.10(GND) U3.17(GND) U3.20(GND) U3.32(GND) U3.42(GND) U3.51(GND) U3.EP(GND) ; port GND_CPU
VSAMW25: C10.2 C11.1 J2.1 R11.2 TP6.1 U3.7(VBAT) U3.21(VCC) ; port MCU_VCC  [project net 3V3]
BUZZER PWM-: U3.9(PA17) ; port BUZZER_PWM
F1: J21.6 U3.50(~{RESETN_WIFI})  [project net F1_3]
F2: J21.5 U3.49(I2C_SDA)  [project net F2_3]
F3: J21.4 U3.48(I2C_SCL)  [project net F3_3]
F4: J21.3 U3.47(GPIO_18/6)  [project net F4_3]
F5: J21.2 U3.46(GPIO_16/5)  [project net F5_3]
F6: J21.1 U3.2(UART_TXD) U3.45(GPIO_15/4)  [project net F6_3]
FF1: J20.6 U3.3(UART_RXD)  [project net FF1_3]
FF2: J20.5 U3.4(CHIP_EN)  [project net FF2_3]
FF3: J20.4 U3.5(GPIO_1)  [project net FF3_3]
FF4: J20.3 U3.6(GPIO_NC/3)  [project net FF4_3]
FF5: J20.2 U3.18(PA24/Host_SPI_SSN)  [project net FF5_3]
FF6: J20.1 U3.19(PA25/Host_SPI_SCK)  [project net FF6_3]
FLASH_MEM_SPI_~{CS}: U3.37(PA07) ; port FLASH_MEM_~{CS}
GREEN_LED_1: U3.36(PA06) ; port GREEN_LED_1
GREEN_LED_2: U3.22(PB22) ; port GREEN_LED_2
I2C_0(SCL) LIGHT SENSOR: U3.39(PA09) ; port SCL_LIGHT_SENSOR
I2C_0(SDA) LIGHT SENSOR: U3.38(PA08) ; port SDA_LIGHT_SENSOR
LCD_SPI1_~{CS}: U3.13(PA20/Host_UART_RXD) ; port LCD_SPI1__~{CS}
LCD_SPI1_CLK: U3.14(PA21/Host_UART_TXD) ; port LCD_SPI1_SCK
LCD_SPI1_MISO: U3.28(PB03) ; port LCD_SPI1_MISO
LCD_SPI1_MOSI: U3.27(PB02) ; port LCD_SPI1_MOSI
LOCK_SIGNAL_SWITCH: U3.15(PA22/Host_SPI_MISO) ; port LOCK_SWITCH
~{MCU_RESET}: C12.2 J2.10 R11.1 R12.2 TP10.1 U3.24(~{RESETN_Host})  [project net ~{MCU_RESET}_3]
MCU_LED: U3.16(PA23/Host_SPI_MOSI) ; port MCU_LED
MCU_RESET: port RESET
MOTOR PWM+: U3.35(PA05) ; port MOTOR_PWM
SERCOM1_PAD2_SPI_CIPO: U3.8(PA16) ; port FLASH_MEM_CIPO
SERCOM1_PAD2_SPI_COPI: U3.11(PA18) ; port FLASH_MEM_COPI
SERCOM1_PAD3_SPI_SCK: U3.12(PA19) ; port FLASH_MEM_CLK
SERCOM4_UART_RX_CLI: U3.44(PB11) ; port UART_RX_CLI  [project net MCU_RxI_UART_CLI]
SERCOM4_UART_TX_CLI: U3.43(PB10) ; port UART_TX_CLI  [project net MCU_TxO_UART_CLI]
SPARE 1: U3.41(PA11) ; port SPARE 1
SPARE 2: U3.40(PA10) ; port SPARE 2
SPARE 3: U3.34(PA04) ; port SPARE 3
SPARE 4: U3.23(PB23) ; port SPARE 4
STATUS RGB PIN_1: U3.31(PA02) ; port STATUS_RGB_RED
STATUS RGB PIN_2: U3.33(PA03) ; port STATUS_RGB_GREEN
SWCLK: J2.4 TP9.1 U3.25(PA30/SWDCLK) ; port SWCLK
SWDIO: J2.2 TP8.1 U3.26(PA31/SWDIO) ; port SWDIO
XIN_32: C13.2 U3.29(PA00/XIN32) X1.1  [project net XIN_32_3]
XOUT_32: C14.2 U3.30(PA01/XOUT32) X1.2  [project net XOUT_32_3]
NetR12_1: R12.1 SW1.3 SW1.4

Not connected (* = marked no-connect by the designer): J2 6* 8*

### Notes on the sheet
- Calculation of crystal load capacitors:
  Cext = 2x ( Ccrystal - Cpara - Cpcb )
  Ccrystal = 12.5pF (from crystal datasheet)
  Cpara = 3.15pF (from MCU datasheet)
  Cpcb = 0.5pF (estimate)
  Cext = 2x(12.5pF - 3.15pF - 0.5pF) = 17.7pF
- Title:
- Desc:
- Size:
- Letter
- Auth:
- Proj:
- Sheet
- of
- www.seas.upenn.edu
- Electrical and Systems Engineering

### Library data of the parts
C10 C11 = CMP-011-000479-1: Capacitor Surface Mount 0805 Footprint 10UF 16V 20% Tolerance Ceramic X7R; Manufacturer: Various; Manufacturer P/N: CAP 0805 10UF 16V 20% X7R; PCB Package: 0805; Description in Visual: Cap SMT 0805 10UF 16V 20% Ceramic X7R; Tolerance: 20%; Type: Ceramic X7R; Mount: SMT; P/N: CAP 0805 10UF 16V 20% X7R; Voltage: 16V; Value: 10UF
C12 = CMP-011-000286-1: Capacitor Surface Mount 0603 Footprint 1UF 16V 10% Tolerance Ceramic X7R; Manufacturer: Various; P/N: CAP 0603 1UF 16V 10% X7R; PCB Package: 0603; Description in Visual: Cap SMT 0603 1UF 16V 10% Ceramic X7R; Manufacturer P/N: CAP 0603 1UF 16V 10% X7R; Tolerance: 10%; Type: Ceramic X7R; Value: 1UF; Mount: SMT; Voltage: 16V
C13 C14 = CMP-011-000283-1: Capacitor Surface Mount 0603 Footprint 18PF 50V 5% Tolerance Ceramic C0G; Manufacturer: Various; Manufacturer P/N: CAP 0603 18PF 50V 5% C0G; Description in Visual: Cap SMT 0603 18PF 50V 5%  Cer C0G; PCB Package: 0603; Voltage: 50V; Type: Ceramic C0G; Tolerance: 5%; Value: 18PF; P/N: CAP 0603 18PF 50V 5% C0G; Mount: SMT
J2 = CMP-002-000013-1: 10 Pin Shrouded Header, 0.050", Key Pin 7; Manufacturer P/N: Various; Manufacturer: Samtech; Gender: Male; Number of Contacts: 10; ComponentLink1URL: http://infocenter.arm.com/help/topic/com.arm.doc.faqs/attached/13634/cortex_debug_connectors.pdf; Description in Visual: 10 Pin Shrouded Header, 0.050", Key Pin 7; P/N: ARM Cortex Debug; Number of Rows: 2; Contact Finish: Gold; ComponentLink1Description: Pinout Reference; ComponentLink2URL: http://suddendocs.samtec.com/catalog_english/ftsh_smt.pdf; Pitch: 0.050"; Orientation: Vertical; ComponentLink2Description: Datasheet for Connector
J20 J21 = CMP-00108-1: Board Connector, 6 Contact(s), 1 Row(s), Male, Straight, 0.1 inch Pitch, Solder Terminal, Locking, Black Insulator, Plug
R11 = CMP-005-002156-3: Resistor Surface Mount, 10K Ohms, 0603 Footprint, 1% Tolerance 0.1W; Manufacturer: Various; PCB Package: 0603; Description in Visual: Res SMT 10K 0603  1%  0.1W; Manufacturer P/N: RES 0603 10K 1%; Tolerance: 1%; Mount: SMT; Value: 10k; JLCPCB Part #: C25804; Power Rating: 0.1W
R12 = CMP-005-002125-2: Resistor Surface Mount, 100 Ohms, 0603 Footprint, 1% Tolerance 0.1W; Manufacturer: Various; Manufacturer P/N: RES 0603 100R 1%; Value: 100; Description in Visual: Res SMT 100 0603  1%  0.1W; PCB Package: 0603; Mount: SMT; Tolerance: 1%; Power Rating: 0.1W
SW1 = CMP-00084-3: Keypad Switch, 1 Switches, SPST, Momentary tactile button, 0.05A, 16VDC, 3.23N, Solder Terminal, Surface Mount-straight; Manufacturer Series: PTS810; Actuator Length: 0.028inch; Electrical Life: 50000Cycles; Contact Resistance: 0.5mR; Solderability: REFLOW; Actuator Travel: 0.1524mm; Actuator Color: White; Actuator Type: Pushbutton; Insulation Resistance: 100MR; Dielectric Withstand Volts: 250VACV; Switch Function: OFF-MOM; Reach SVHC Compliant: Yes; Terminal Finish: Silver; Switch Type: Keypad; Switch Action: MOMENTARY; RoHS Compliant: Yes; JESD-609 Code: e4; Max Operating Temperature: 85°C; Termination: Solder; Min Operating Temperature: -40°C; Mounting Technology: Surface Mount; Circuit: SPST; Type: Tactile
TP6-TP10 = CMP-00049-4: as TP1 on sheet Main
U3 = CMP-00071-2: WiFi 802.11b/g/n Transceiver Module 2.412GHz ~ 2.484GHz Integrated, Trace Surface Mount, Integrated SAMD21 Cortex M0+
X1 = CMP-0447-00001-4: Crystal 32.768kHz ±20ppm (Tol) 12.5pF FUND 70kΩ 2-Pin CSMD T/R; ESR (Equivalent Series Resistance): 70kR; Frequency: 32.768kHz; Radiation Hardening: No; Length: 3.2mm; Max Operating Temperature: 85°C; Number of Pins: 2; Series: ABS07; Min Operating Temperature: -40°C; Frequency Tolerance: 20ppm; Packaging: Tape and Reel; Height: 0.9mm; Width: 1.5mm; Depth: 1.5mm; Load Capacitance: 12.5pF; RoHS Compliant: Yes; Tolerance: 20ppm; Termination: SMD/SMT; Lead Free: Lead Free; Series Resistance: 70kR; REACH SVHC: No SVHC; Case/Package: CSMD; Operating Frequency: 32.768 kHz; Package Quantity: 3000

## Sheet LiPo_Charger.SchDoc
size Legal; Author: Mark & Qiming; DocumentNumber: 6; SheetNumber: 6; SheetTotal: 9
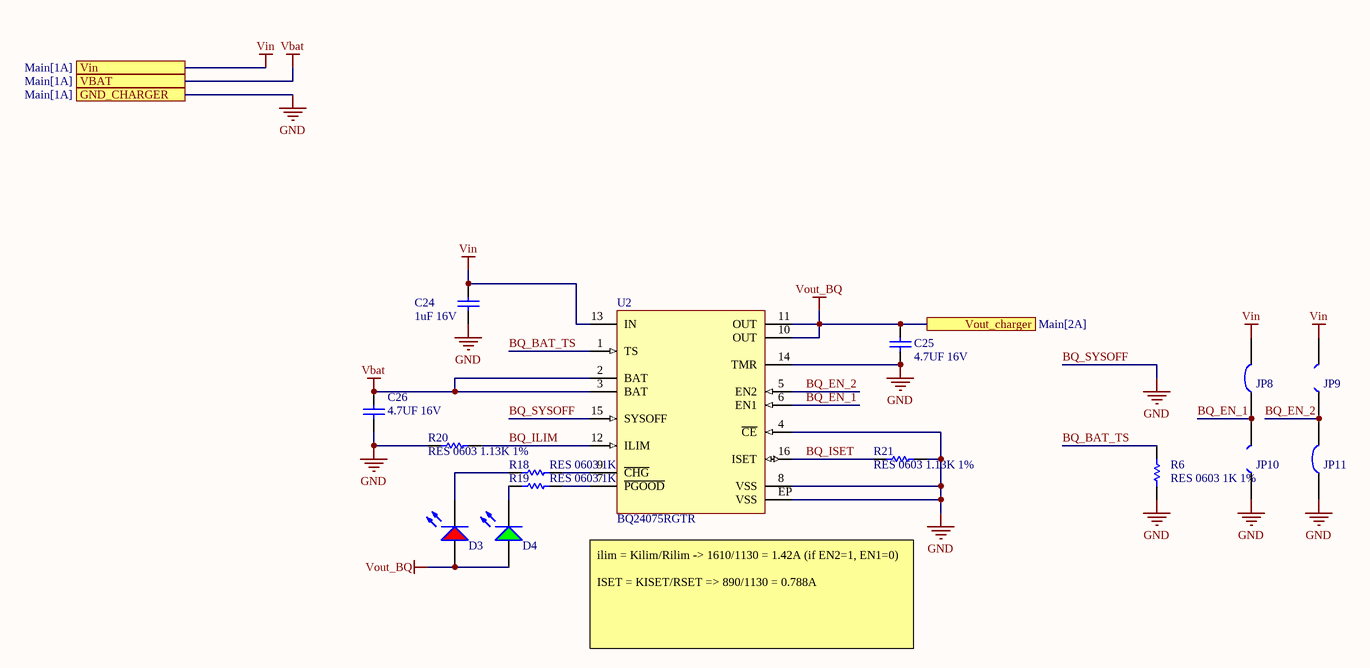
[diagram p3: LiPo_Charger.SchDoc]

### Parts
C24  1uF 16V  [0603_CAP]
C25  4.7UF 16V  [0805_CAP]
C26  4.7UF 16V  [0805_CAP]
D3  LSM0805412V  [LED_0805_RED]  (value not drawn)
D4  LSM0805452V  [LED_0805]  (value not drawn)
JP8  0603 link  [0603_JP_RES]  (value not drawn)  (net tie, no BOM)
JP9  0603 link (Open)  [0603_JP_Open]  (value not drawn)  (no BOM)
JP10  0603 link (Open)  [0603_JP_Open]  (value not drawn)  (no BOM)
JP11  0603 link  [0603_JP_RES]  (value not drawn)  (net tie, no BOM)
R6  RES 0603 1K 1%  [0603_RES]
R18  RES 0603 1K 1%  [0603_RES]
R19  RES 0603 1K 1%  [0603_RES]
R20  RES 0603 1.13K 1%  [0603_RES]
R21  RES 0603 1.13K 1%  [0603_RES]
U2  BQ24075RGTR  [FP-RGT0016C-IPC_A]

### Ports
GND_CHARGER (see Main[1A]), VBAT (see Main[1A]), Vin (see Main[1A]), Vout_charger (see Main[2A])

### Nets
GND: C24.1 C25.1 C26.1 JP10.1 JP11.2 R6.1 R20.1 R21.2 U2.4(~{CE}) U2.8(VSS) U2.14(TMR) U2.15(SYSOFF) U2.EP(VSS) ; port GND_CHARGER  [also labelled BQ_SYSOFF]
VBAT: C26.2 U2.2(BAT) U2.3(BAT) ; port VBAT
Vin: C24.2 JP8.2 JP9.1 U2.13(IN) ; port Vin  [project net VUSB]
Vout_BQ: C25.2 D3.A D4.A U2.10(OUT) U2.11(OUT) ; port Vout_charger  [project net Vsystem]
BQ_BAT_TS: R6.2 U2.1(TS)  [project net BQ_BAT_TS_6]
BQ_EN_1: JP8.1 JP10.2 U2.6(EN1)  [project net BQ_EN_1_6]
BQ_EN_2: JP9.2 JP11.1 U2.5(EN2)  [project net BQ_EN_2_6]
BQ_ILIM: R20.2 U2.12(ILIM)  [project net BQ_ILIM_6]
BQ_ISET: R21.1 U2.16(ISET)  [project net BQ_ISET_6]
NetD3_K: D3.K R18.2
NetD4_K: D4.K R19.2
NetR18_1: R18.1 U2.9(~{CHG})
NetR19_1: R19.1 U2.7(~{PGOOD})

### Notes on the sheet
- (near U2) ilim = Kilim/Rilim -> 1610/1130 = 1.42A (if EN2=1, EN1=0)
  ISET = KISET/RSET => 890/1130 = 0.788A
- Title:
- Desc:
- Size:
- Letter
- Auth:
- Proj:
- Sheet
- of
- www.seas.upenn.edu
- Electrical and Systems Engineering

### Library data of the parts
C24 = CMP-011-000286-1: as C12 on sheet MCU; Manufacturer P/N: CAP 0603 1UF 16V 10% X7R; Tolerance: 10%; Type: Ceramic X7R; Value: 1UF; Mount: SMT; Voltage: 16V
C25 C26 = CMP-011-000523-1: as C4 on sheet FTDI; Mount: SMT; P/N: CAP 0805 4.7UF 16V 10% X7R; Type: Ceramic X7R; Voltage: 16V; Tolerance: 10%; Value: 4.7UF
D3 = CMP-00026-00001-1: as D5 on sheet FTDI; RoHS Compliant: Yes
D4 = CMP-00038-3: as D8 on sheet Main; RoHS Compliant: Yes
JP8 JP11 = CMP-00422-2: as JP1 on sheet Main; Source: Shunts and Jumpers.SchLib; Pin Count: 2; Design Item ID: 0603 link; Component Type: Net Tie; P/N: 0603 link
JP9 JP10 = CMP-00423-2: 0O link, Solder Bridge/SMD, Open; Value: 10000000000meg; P/N: 0603 link (Open); Description in Visual: 0O link, Solder Bridge/SMD, Open; Component Type: Standard (No BOM); Design Item ID: 0603 link (Open); Pin Count: 2; Source: Shunts and Jumpers.SchLib
R6 R18 R19 = CMP-005-002503-3: as R7 on sheet Main; Tolerance: 1%; Value: 1k; Mount: SMT; Power Rating: 0.1W; Manufacturer P/N: RES 0603 1K 1%; JLCPCB Part #: C21190
R20 R21 = CMP-005-001984-2: Resistor Surface Mount, 1.13K Ohms, 0603 Footprint, 1% Tolerance 0.1W; Manufacturer: Various; Description in Visual: Res SMT 1.13K 0603  1%  0.1W; PCB Package: 0603; Power Rating: 0.1W; Mount: SMT; Tolerance: 1%; Manufacturer P/N: RES 0603 1.13K 1%; Value: 1.13k
U2 = CMP-00080-5: Power Supply Support Circuit, Adjustable, 1 Channel, 6.6, PQCC16; Nominal Supply Voltage: 5V; Channels: 1; Min Supply Voltage: 4.35V; Qualification Status: Not Qualified; Power Supplies: 4.5/6.3V; Package Equivalence Code: LCC16,.12SQ,20; Adjustable Threshold: Yes; Package Body Material: Plastic; Max Supply Voltage: 26V; Supply Current-Max (Isup): 1.5mA; Reach SVHC Compliant: Yes; RoHS Compliant: Yes; Throw Configuration: POWER SUPPLY SUPPORT CIRCUIT; Moisture Sensitivity Level: 2; Min Operating Temperature: -40°C; JESD-609 Code: e4; Width: 3mm; Terminal Form: No Lead; Terminal Finish: Nickel; Terminal Position: QUAD; Height - Seated (Max): 1mm; Temperature Grade: INDUSTRIAL; Case/Package: HVQCCN; Length: 3mm; Max Operating Temperature: 85°C; Peak Reflow Temperature (Cel): 260°C; Number of Channels: 1; Package Shape: Square; Package Style: CHIP CARRIER, HEAT SINK/SLUG, VERY THIN PROFILEMeter; Surface Mount: Yes; Pins: 16; JESD-30 Code: S-PQCC-N16; Terminal Pitch: 0.5mm

## Sheet Memory.SchDoc
size Legal; Author: Mark & Qiming; DocumentNumber: 2; SheetNumber: 2; SheetTotal: 9
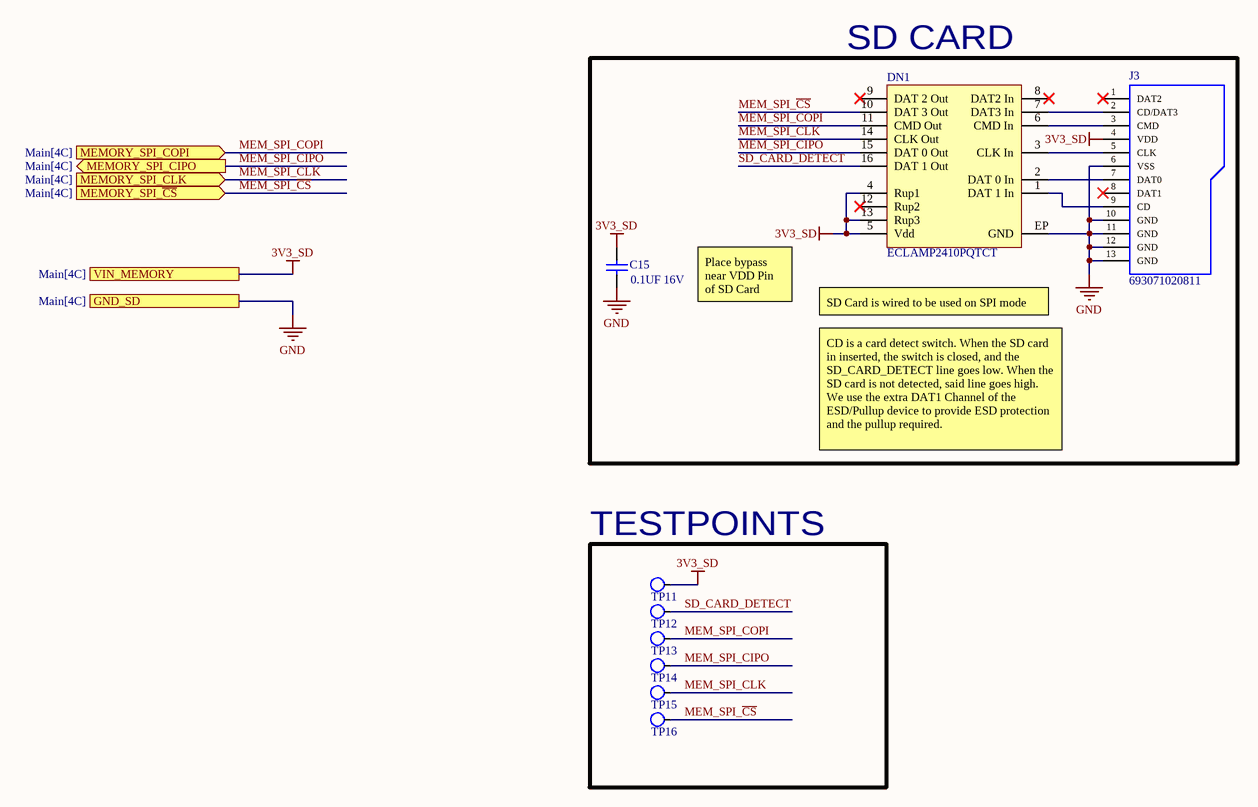
[diagram p4: Memory.SchDoc]

### Parts
C15  0.1UF 16V  [0603_CAP]
DN1  ECLAMP2410PQTCT  [ECLAMP2410PQTCT-Footprint-1]
J3  693071020811  [693071020811]
TP11  Testpad  [SMT Testpoint, 50mil]  (value not drawn)  (no BOM)
TP12  Testpad  [SMT Testpoint, 50mil]  (value not drawn)  (no BOM)
TP13  Testpad  [SMT Testpoint, 50mil]  (value not drawn)  (no BOM)
TP14  Testpad  [SMT Testpoint, 50mil]  (value not drawn)  (no BOM)
TP15  Testpad  [SMT Testpoint, 50mil]  (value not drawn)  (no BOM)
TP16  Testpad  [SMT Testpoint, 50mil]  (value not drawn)  (no BOM)

### Blocks framed on the sheet
SD CARD: C15 DN1 J3
TESTPOINTS: TP11-TP16

### Ports
GND_SD (see Main[4C]), MEMORY_SPI_CIPO (out, see Main[4C]), MEMORY_SPI_CLK (in, see Main[4C]), MEMORY_SPI_COPI (in, see Main[4C]), MEMORY_SPI_~{CS} (in, see Main[4C]), VIN_MEMORY (see Main[4C])

### Nets
3V3_SD: C15.2 DN1.4(Rup1) DN1.5(Vdd) DN1.13(Rup3) J3.4(VDD) TP11.1 ; port VIN_MEMORY  [project net 3V3]
GND: C15.1 DN1.EP(GND) J3.6(VSS) J3.10(GND) J3.11(GND) J3.12(GND) J3.13(GND) ; port GND_SD
MEM_SPI_~{CS}: DN1.10(DAT_3_Out) TP16.1 ; port MEMORY_SPI_~{CS}  [project net FLASH_MEM_SPI_~{CS}]
MEM_SPI_CIPO: DN1.15(DAT_0_Out) TP14.1 ; port MEMORY_SPI_CIPO
MEM_SPI_CLK: DN1.14(CLK_Out) TP15.1 ; port MEMORY_SPI_CLK
MEM_SPI_COPI: DN1.11(CMD_Out) TP13.1 ; port MEMORY_SPI_COPI
SD_CARD_DETECT: DN1.16(DAT_1_Out) TP12.1  [project net SD_CARD_DETECT_2]
NetDN1_1: DN1.1(DAT_1_In) J3.9(CD)
NetDN1_2: DN1.2(DAT_0_In) J3.7(DAT0)
NetDN1_3: DN1.3(CLK_In) J3.5(CLK)
NetDN1_6: DN1.6(CMD_In) J3.3(CMD)
NetDN1_7: DN1.7(DAT3_In) J3.2(CD/DAT3)

Not connected (* = marked no-connect by the designer): DN1 8(DAT2_In)* 9(DAT_2_Out)* 12(Rup2)*; J3 1(DAT2)* 8(DAT1)*

### Notes on the sheet
- Place bypass near VDD Pin of SD Card
- SD Card is wired to be used on SPI mode
- CD is a card detect switch. When the SD card in inserted, the switch is closed, and the SD_CARD_DETECT line goes low. When the SD card is not detected, said line goes high. We use the extra DAT1 Channel of the ESD/Pullup device to provide ESD protection and the pullup required.
- Title:
- Desc:
- Size:
- Letter
- Auth:
- Proj:
- Sheet
- of
- www.seas.upenn.edu
- Electrical and Systems Engineering

### Library data of the parts
C15 = CMP-011-000221-1: as C1 on sheet FTDI; Mount: SMT; Type: Ceramic X7R; Voltage: 16V; P/N: CAP 0603 0.1UF 16V 10% X7R; Value: 0.1UF; Tolerance: 10%
DN1 = CMP-00096-2: Trans Voltage Suppressor Diode, 5V V(RWM), Bidirectional, 7 Element, Silicon with EMI Filter; Filter Type: DATA LINE FILTER; Reach SVHC Compliant: Yes; RoHS Compliant: Yes
J3 = CMP-00419-3: WR-CRD Micro SD Card Connector Push & Push; Rated Current: 0.5A; Working Voltage: 30VAC; Contact Resistance: 100mOhm; Gender: Socket; Withstanding Voltage: 500VAC; Pin Number: 8; Mounting Technology: SMT; Source: WR-CRD.SchLib; Type: Push & Push; ComponentLink2Description: Datasheet; Packaging: Tape and Reel; ComponentLink1Description: Manufacturer; Design Item ID: 693071020811; Memory Card Type: Micro SD; Publisher: Wurth Elektronik; Operating Temperature: -40 to +85degC; ComponentLink2URL: https://katalog.we-online.com/em/datasheet/693071020811.pdf; Number of Contacts: 8; Part Number: 693071020811; Published Date: November 2019; ComponentLink1URL: http://www.we-online.de
TP11-TP16 = CMP-00049-4: as TP1 on sheet Main

## Sheet BUCK.SchDoc
size Legal; Author: Mark & Qiming; DocumentNumber: 8; SheetNumber: 7; SheetTotal: 9
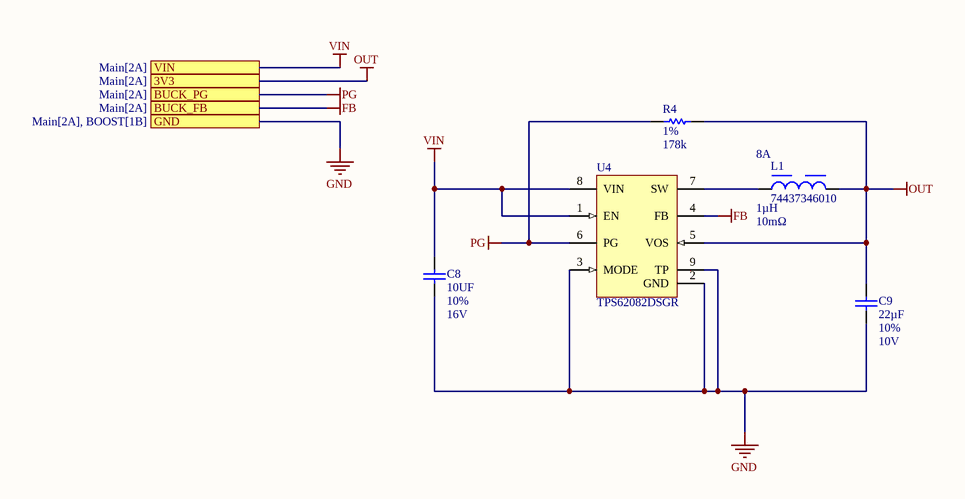
[diagram p5: BUCK.SchDoc]

### Parts
C8  value 10UF  Tolerance: 10%  Voltage: 16V  [1206_CAP]  (hidden comment: CAP 1206 10UF 16V 10% X7R)
C9  value 22µF  Tolerance: 10%  Voltage: 10V  [1206_CAP_75H]  (hidden comment: CAP 1206 22UF 10V 10% X7R)
L1  74437346010  Series Resistance: 10mΩ  Inductance: 1µH  Current Rating: 8A  [WE-LHMI_7030]
R4  value 178k  Tolerance: 1%  [0603_RES]  (hidden comment: RES 0603 178K 1%)
U4  TPS62082DSGR  [DSG0008A_V]

### Ports
3V3 (see Main[2A]), BUCK_FB (see Main[2A]), BUCK_PG (see Main[2A]), GND (see Main[2A], BOOST[1B]), VIN (see Main[2A])

### Nets
FB: U4.4(FB) ; port BUCK_FB  [project net VBUFB]
GND: C8.1 C9.1 U4.2(GND) U4.3(MODE) U4.9(TP) ; port GND
OUT: C9.2 L1.2 R4.1 U4.5(VOS) ; port 3V3
PG: R4.2 U4.6(PG) ; port BUCK_PG  [project net VBUPG]
VIN: C8.2 U4.1(EN) U4.8(VIN) ; port VIN
NetL1_1: L1.1 U4.7(SW)

### Notes on the sheet
- Title:
- Desc:
- Size:
- Letter
- Auth:
- Proj:
- Sheet
- of
- www.seas.upenn.edu
- Electrical and Systems Engineering

### Library data of the parts
C8 = CMP-011-000639-1: Capacitor Surface Mount 1206 Footprint 10UF 16V 10% Tolerance Ceramic X7R; Manufacturer: Various; PCB Package: 1206; Description in Visual: Cap SMT 1206 10UF 16V 10%  Cer X7R; Type: Ceramic X7R; Mount: SMT; P/N: CAP 1206 10UF 16V 10% X7R; Manufacturer P/N: CAP 1206 10UF 16V 10% X7R
C9 = CMP-011-000660-3: Capacitor Surface Mount 1206 Footprint 22UF 10V 10% Tolerance Ceramic X7R; Manufacturer: Various; PCB Package: 1206; Description in Visual: Cap SMT 1206 22UF 10V 10%  Cer X7R; Manufacturer P/N: CAP 1206 22UF 10V 10% X7R; RoHS: Yes; P/N: CAP 1206 22UF 10V 10% X7R; Case/Package: 1206; JLCPCB Part #: C5672; Mount: SMT; Type: Ceramic X7R; Capacitor Type: Ceramic
L1 = CMP-1353-00047-3: NexarPartId: 22866635; Shielding: Shielded; Core Material: Composite, Ferrite; DC Resistance (DCR): 8.3mΩ; Frequency: 54MHz; Inductance Tolerance: 20%; Test Frequency: 100kHz; Saturation Current: 14.7A; Length: 7.3mm; Depth: 6.6mm; Max Operating Temperature: 125°C; Min Operating Temperature: -40°C; Packaging: Tape & Reel (TR); Mount: Surface Mount; Self Resonant Frequency: 54MHz; REACH SVHC: Unknown; RMS Current (Irms): 8A; RoHS: Compliant; Height: 2.8mm; Ambient Temperature Range Low: -40°C; Tolerance: 20%; Width: 6.6mm; Composition: Wirewound; Height - Seated (Max): 3.0988mm; Case/Package: Nonstandard; Ambient Temperature Range High: 85°C; Max DC Current: 8A; Termination: SMD/SMT
R4 = CMP-005-002436-2: Resistor Surface Mount, 178K Ohms, 0603 Footprint, 1% Tolerance 0.1W; Manufacturer: Various; PCB Package: 0603; Description in Visual: Res SMT 178K 0603  1%  0.1W; Mount: SMT; Manufacturer P/N: RES 0603 178K 1%; Power Rating: 0.1W
U4 = CMP-0323-00344-3: Buck Step Down Regulator with 2.3 to 6 V Input and 3.3 V Output, -40 to 85 degC, 8-Pin WSON (DSG), Green (RoHS & no Sb/Br); Manufacturer: Texas Instruments; Switch Current Limit(Typ)(A): 2.4; Vin(Min)(V): 2.3; Iq(Typ)(mA): 0.006; Regulated Outputs(#): 1; Vout(Max)(V): 3.3; Duty Cycle(Max)(%): 100; Iout(Max)(A): 1.2; SubFamily: Step-Down Regulator; Rating: Catalog; Vin(Max)(V): 6; ComponentLink1Description: Datasheet; ComponentLink3Description: URL Link1; ComponentLink2URL: http://www.ti.com/litv/pdf/mpds308a; DatasheetVersion: SLVSAE8B; PackageVersion: revB, Oct-2010; Eco-Plan: Green (RoHS & no Sb/Br); ComponentLink2Description: Package Specification; PackageReference: DSG0008A; Code_JEDEC: MO-229; Topology: Buck; PartNumber: TPS62082DSGR; PackageDescription: 8-Pin Plastic Small Outline No-Lead, 2 x 2 x 0.8 mm Body, 0.5 mm Pitch, Exposed Pad; ComponentLink1URL: http://www.ti.com/general/docs/lit/getliterature.tsp?genericPartNumber=TPS62082&fileType=pdf; ComponentLink3URL: Samples URL:http://www.ti.com/product/tps62082#samples; Vout(Min)(V): 3.3; Mounting Technology: Surface Mount

## Sheet BOOST.SchDoc
size Legal; Author: Mark & Qiming; DocumentNumber: 9; SheetNumber: 8; SheetTotal: 9
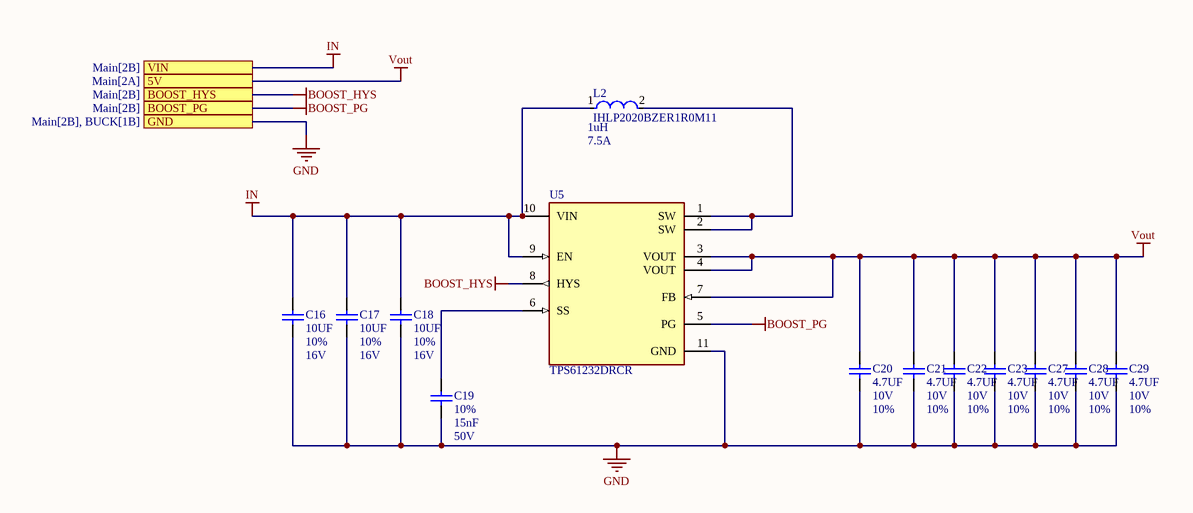
[diagram p6: BOOST.SchDoc]

### Parts
C16  value 10UF  Tolerance: 10%  Voltage: 16V  [1206_CAP]  (hidden comment: CAP 1206 10UF 16V 10% X7R)
C17  value 10UF  Tolerance: 10%  Voltage: 16V  [1206_CAP]  (hidden comment: CAP 1206 10UF 16V 10% X7R)
C18  value 10UF  Tolerance: 10%  Voltage: 16V  [1206_CAP]  (hidden comment: CAP 1206 10UF 16V 10% X7R)
C19  value 15nF  Tolerance: 10%  Voltage: 50V  [0603_CAP]  (hidden comment: CAP 0603 1500PF 50V 10% X7R)
C20  value 4.7UF  Voltage: 10V  Tolerance: 10%  [0603_CAP]  (hidden comment: CAP 0603 4.7UF 10V 10% X5R)
C21  value 4.7UF  Voltage: 10V  Tolerance: 10%  [0603_CAP]  (hidden comment: CAP 0603 4.7UF 10V 10% X5R)
C22  value 4.7UF  Voltage: 10V  Tolerance: 10%  [0603_CAP]  (hidden comment: CAP 0603 4.7UF 10V 10% X5R)
C23  value 4.7UF  Voltage: 10V  Tolerance: 10%  [0603_CAP]  (hidden comment: CAP 0603 4.7UF 10V 10% X5R)
C27  value 4.7UF  Voltage: 10V  Tolerance: 10%  [0603_CAP]  (hidden comment: CAP 0603 4.7UF 10V 10% X5R)
C28  value 4.7UF  Voltage: 10V  Tolerance: 10%  [0603_CAP]  (hidden comment: CAP 0603 4.7UF 10V 10% X5R)
C29  value 4.7UF  Voltage: 10V  Tolerance: 10%  [0603_CAP]  (hidden comment: CAP 0603 4.7UF 10V 10% X5R)
L2  IHLP2020BZER1R0M11  Current Rating: 7.5A  Inductance: 1uH  [FP-IHLP-2020BZ-FP_1_905x2-MFG]
U5  TPS61232DRCR  [FP-DRC0010G-IPC_A]

### Ports
5V (see Main[2A]), BOOST_HYS (see Main[2B]), BOOST_PG (see Main[2B]), GND (see Main[2B], BUCK[1B]), VIN (see Main[2B])

### Nets
BOOST_HYS: U5.8(HYS) ; port BOOST_HYS  [project net VBOHYS]
BOOST_PG: U5.5(PG) ; port BOOST_PG  [project net VBOPG]
GND: C16.1 C17.1 C18.1 C19.1 C20.1 C21.1 C22.1 C23.1 C27.1 C28.1 C29.1 U5.11(GND) ; port GND
IN: C16.2 C17.2 C18.2 L2.1 U5.9(EN) U5.10(VIN) ; port VIN
Vout: C20.2 C21.2 C22.2 C23.2 C27.2 C28.2 C29.2 U5.3(VOUT) U5.4(VOUT) U5.7(FB) ; port 5V
NetC19_2: C19.2 U5.6(SS)
NetL2_2: L2.2 U5.1(SW) U5.2(SW)

### Notes on the sheet
- Title:
- Desc:
- Size:
- Letter
- Auth:
- Proj:
- Sheet
- of
- www.seas.upenn.edu
- Electrical and Systems Engineering

### Library data of the parts
C16-C18 = CMP-011-000639-1: as C8 on sheet BUCK; Type: Ceramic X7R; Mount: SMT; P/N: CAP 1206 10UF 16V 10% X7R; Manufacturer P/N: CAP 1206 10UF 16V 10% X7R
C19 = CMP-011-000275-1: Capacitor Surface Mount 0603 Footprint 1500PF 50V 10% Tolerance Ceramic X7R; Manufacturer: Various; Description in Visual: Cap SMT 0603 1500PF 50V 10%  Cer X7R; PCB Package: 0603; Manufacturer P/N: CAP 0603 1500PF 50V 10% X7R; Mount: SMT; Type: Ceramic X7R; P/N: CAP 0603 1500PF 50V 10% X7R
C20-C23 C27-C29 = CMP-011-000329-1: Capacitor Surface Mount 0603 Footprint 4.7UF 10V 10% Tolerance Ceramic X5R; Manufacturer: Various; PCB Package: 0603; Description in Visual: Cap SMT 0603 4.7UF 10V 10%  Cer X5R; Mount: SMT; Type: Ceramic X5R; P/N: CAP 0603 4.7UF 10V 10% X5R; Manufacturer P/N: CAP 0603 4.7UF 10V 10% X5R
L2 = CMP-02424-000397-1: Fixed Inductors Commercial Low DCR Series 1uH 7.5A 18.1mΩ 20%; Saturation Current: 7A; Test Frequency: 100kHz; Shielding: Shielded; Self Resonant Frequency: 1MHz; DC Resistance (DCR): 18.1mR; Inductance Tolerance: 20%; Min Operating Temperature: -55°C; Depth: 5.43mm; Case/Package: 2020; Package Quantity: 2000; Tolerance: 20%; Length: 5.74mm; Military Standard: Not; Height - Seated (Max): 0.079inch; Width: 0.204inch; Max Operating Temperature: 125°C; Lead Free: Lead Free; Radiation Hardening: No; Contact Plating: Tin; Max DC Current: 7A; Packaging: Tape and Reel; RMS Current (Irms): 7.5A; Mount: Surface Mount; Height: 2mm; Termination: SMD/SMT
U5 = CMP-04918-000377-1: IC REG BOOST 5V 4A 10VSON; Max Input Voltage: 5.5V; Quiescent Current: 35uA; Min Input Voltage: 2.3V; Max Output Current: 2.1A; Number of Outputs: 1; Switching Frequency: 2MHz; Efficiency: 96%; Output Type: Fixed; Lead Free: Lead Free; Min Operating Temperature: -40°C; RoHS Compliant: Yes; Output Voltage: 5V; Number of Pins: 10; Max Operating Temperature: 85°C; Contact Plating: Gold; Topology: Boost; Mount: Surface Mount; Operating Supply Voltage: 5.5V

## Sheet STATUS_RGB.SchDoc
size Legal; Author: Mark & Qiming; DocumentNumber: 4; SheetNumber: 4; SheetTotal: 9
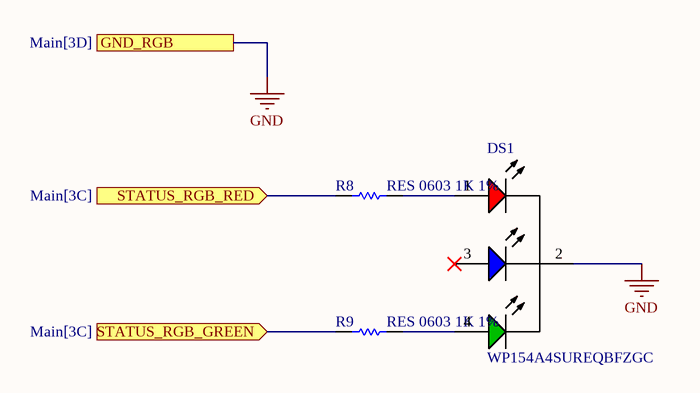
[diagram p7: STATUS_RGB.SchDoc]

### Parts
DS1  WP154A4SUREQBFZGC  [KING-WP154A4SUREQBFZGC_V]
R8  RES 0603 1K 1%  [0603_RES]
R9  RES 0603 1K 1%  [0603_RES]

### Ports
GND_RGB (see Main[3D]), STATUS_RGB_GREEN (in, see Main[3C]), STATUS_RGB_RED (in, see Main[3C])

### Nets
GND: DS1.2(CATHODE) ; port GND_RGB
STATUS_RGB_GREEN: R9.2 ; port STATUS_RGB_GREEN
STATUS_RGB_RED: R8.2 ; port STATUS_RGB_RED
NetDS1_1: DS1.1(RED) R8.1
NetDS1_4: DS1.4(GREEN) R9.1

Not connected (* = marked no-connect by the designer): DS1 3(BLUE)*

### Notes on the sheet
- Title:
- Desc:
- Size:
- Letter
- Auth:
- Proj:
- Sheet
- of
- www.seas.upenn.edu
- Electrical and Systems Engineering

### Library data of the parts
DS1 = CMP-2000-07415-1: Full Color LED Lamp, Dominant Wavelength RGB 630 / 525 / 465 nm, -40 to 85 degC, 4-Pin THD, RoHS; Manufacturer: Kingbright; Viewing Angle: 50°; Wavelength - Dominant: 630nm,525nm,465nm; Online Catalog: 5mm,T-13/4(RGB)RoundwithDomedTopLEDLamp; Millicandela Rating: 1300mcdRed,1700mcdGreen,900mcdBlue; Other Names: 754-1615 / WP154A4SUREQBFZGC-ND; Current - Test: 20mA; Wavelength - Peak: 645nm,515nm,460nm; Color: Red,Green,Blue(RGB); Voltage - Forward (Vf) (Typ): 1.9VRed,3.3VGreen,3.3VBlue; Lens Type: Clear; 3D Model: WP154A4SUREQBFZGW.sldprt / WP154A4SUREQBFZGW.pro / WP154A4SUREQBFZGW.igs / WP154A4SUREQBFZGW.stp; Lens Style/Size: RoundwithDomedTop,5mm,T-13/4; Packaging: Bulk; Datasheet URL: https://www.kingbrightusa.com/images/catalog/spec/WP154A4SUREQBFZGC.pdf; Family: LEDIndication-Discrete; Datasheet Version: Rev. 5A, 08/2014; Category: Optoelectronics; Manufacturer URL: http://www.kingbright.com/; Height: 8.60mm; Mounting Type: ThroughHole; Package Reference: WP154A4SUREQBFZGC; Mounting Technology: ThroughHole; Package Description: 4-Pin Through Hole LED, Dia 5.9 mm, Pitch 1.27 mm; Standard Package: 500; Package / Case: Radial-4Leads; ComponentLink1Description: New link; ComponentLink1URL: *
R8 R9 = CMP-005-002503-3: as R7 on sheet Main; Tolerance: 1%; Value: 1k; Mount: SMT; Power Rating: 0.1W; Manufacturer P/N: RES 0603 1K 1%; JLCPCB Part #: C21190

## Sheet 358LCD.SchDoc
size Legal; Author: Mark & Qiming; DocumentNumber: 10; SheetNumber: 9; SheetTotal: 9
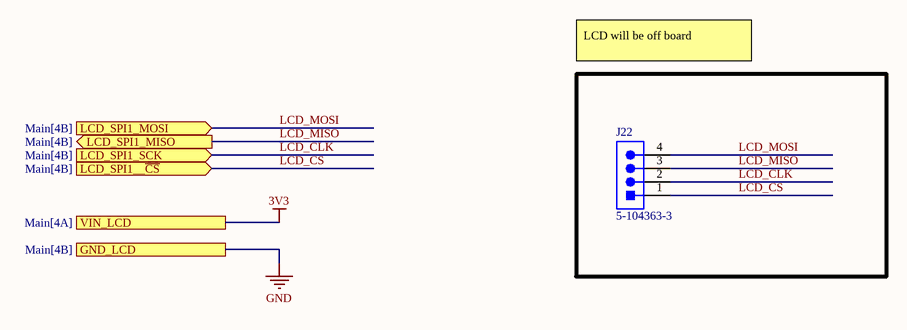
[diagram p8: 358LCD.SchDoc]

### Parts
J22  5-104363-3  [5-104363-3-Footprint-1]

### Ports
GND_LCD (see Main[4B]), LCD_SPI1__~{CS} (in, see Main[4B]), LCD_SPI1_MISO (out, see Main[4B]), LCD_SPI1_MOSI (in, see Main[4B]), LCD_SPI1_SCK (in, see Main[4B]), VIN_LCD (see Main[4A])

### Nets
LCD_~{CS}: J22.1 ; port LCD_SPI1__~{CS}
LCD_CLK: J22.2 ; port LCD_SPI1_SCK
LCD_MISO: J22.3 ; port LCD_SPI1_MISO
LCD_MOSI: J22.4 ; port LCD_SPI1_MOSI

### Notes on the sheet
- LCD will be off board
- Title:
- Desc:
- Size:
- Letter
- Auth:
- Proj:
- Sheet
- of
- www.seas.upenn.edu
- Electrical and Systems Engineering

### Library data of the parts
J22 = CMP-00105-2: as J18 on sheet Main